# EAGLE design ESP12E.3 (EAGLE 8.3.1)
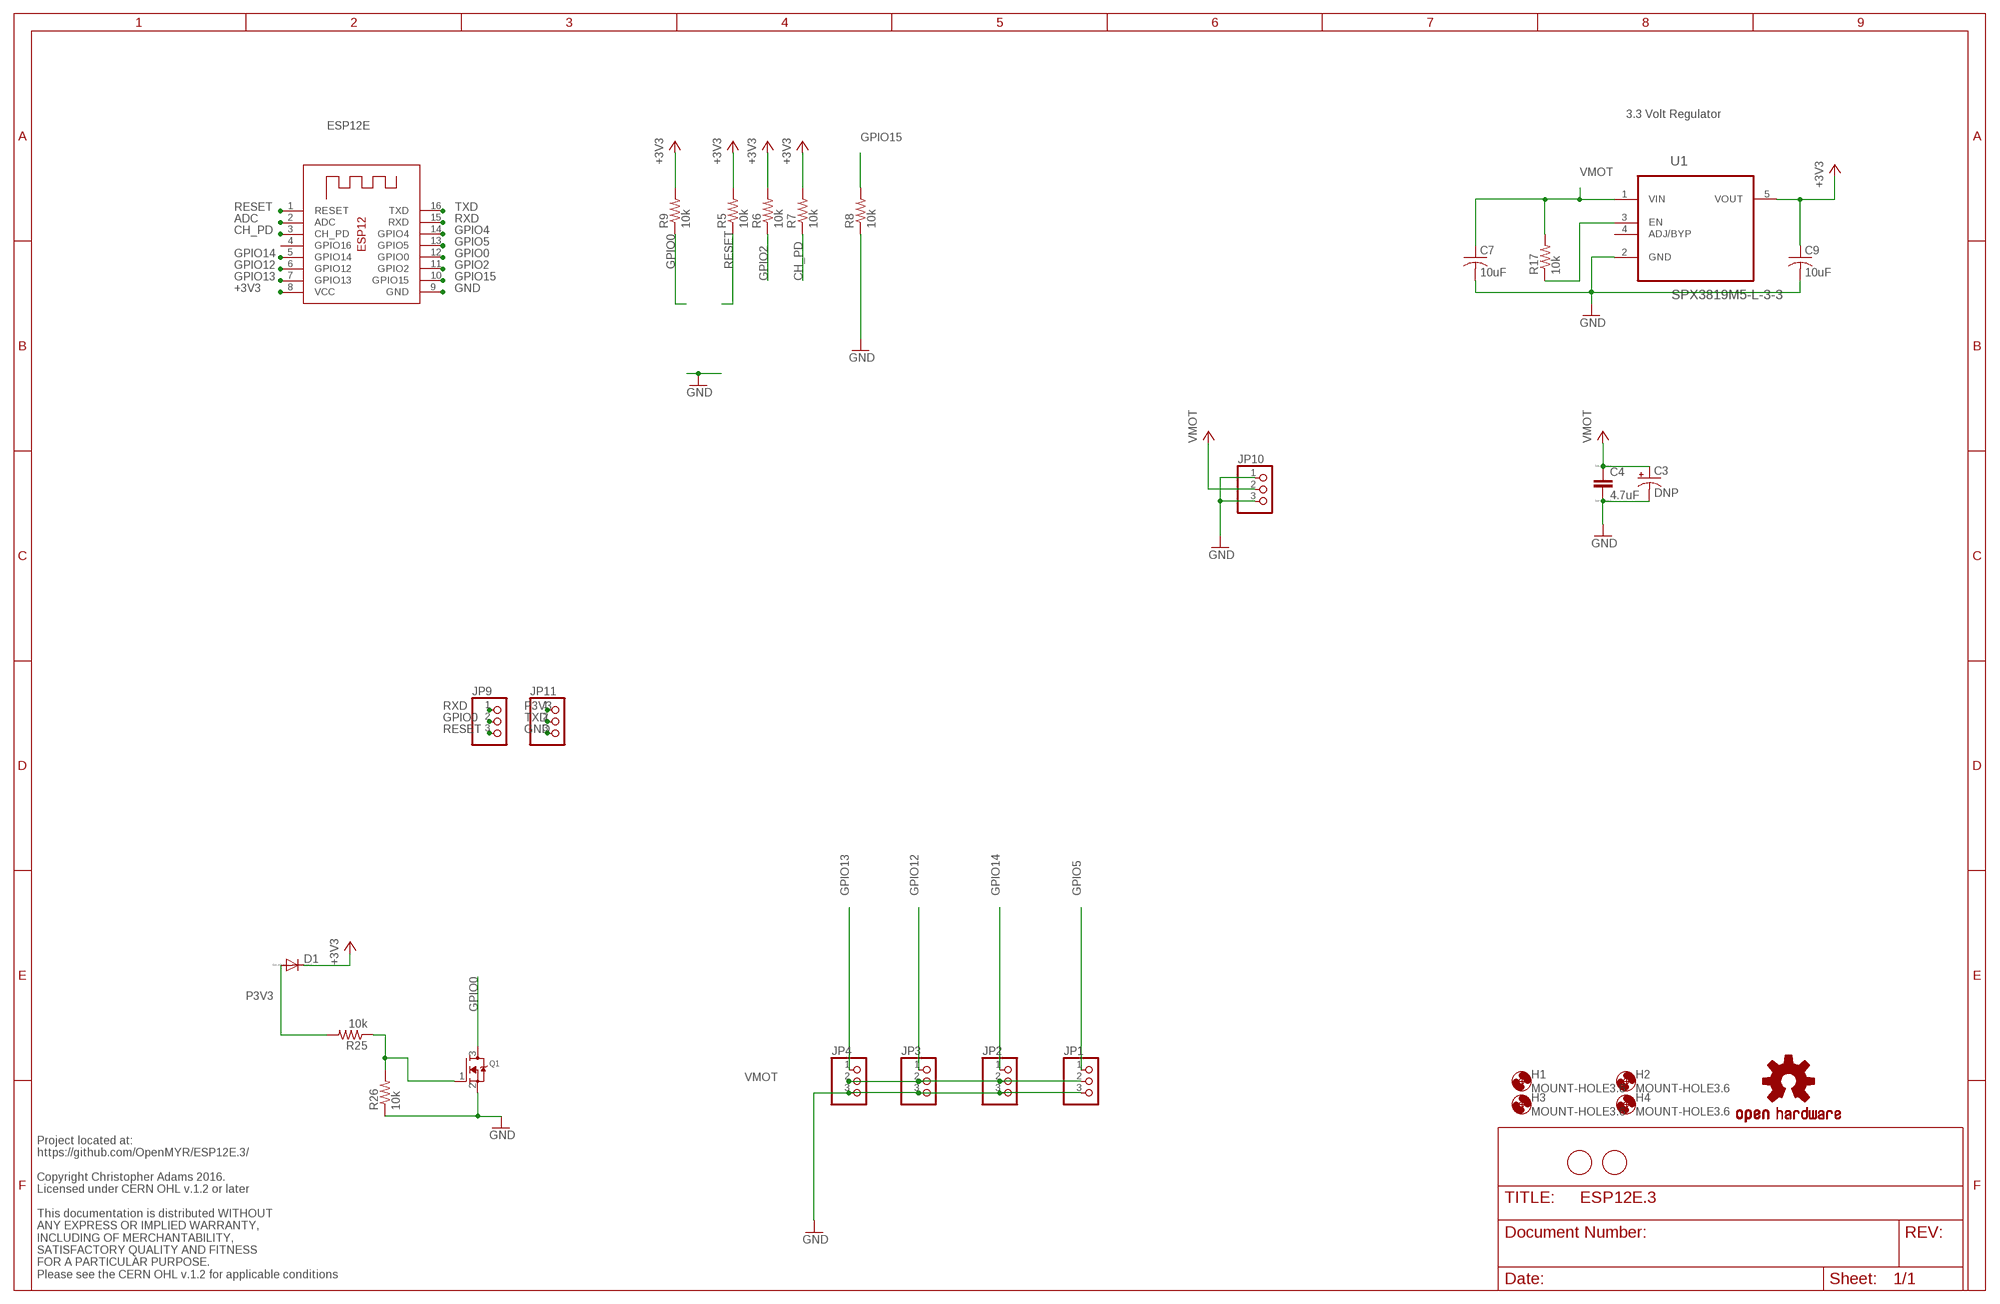
[diagram p0: schematic, sheet 1]

## Parts
C3  DNP  CPOL-USE2-4  [E2-4]
C4  4.7uF  C  [C0805]
C7  10uF  C-USC0603K  [C0603K]
C9  10uF  C-USC0603K  [C0603K]
D1  DIODE-DO214AC  [DO214AC]
H1  MOUNT-HOLE3.6  [3,6]
H2  MOUNT-HOLE3.6  [3,6]
H3  MOUNT-HOLE3.6  [3,6]
H4  MOUNT-HOLE3.6  [3,6]
JP1  PINHD-1X3  [1X03]
JP2  PINHD-1X3  [1X03]
JP3  PINHD-1X3  [1X03]
JP4  PINHD-1X3  [1X03]
JP9  PINHD-1X3  [1X03]
JP10  PINHD-1X3  [1X03]
JP11  PINHD-1X3  [1X03]
LOGO1  OSHW-LOGOMINI  [OSHW-LOGO-MINI]
Q1  MOSFET-NREFLOW  [SOT23]
R5  10k  R-US_R0603  [R0603]
R6  10k  R-US_R0603  [R0603]
R7  10k  R-US_R0603  [R0603]
R8  10k  R-US_R0603  [R0603]
R9  10k  R-US_R0603  [R0603]
R17  10k  R-US_R0603  [R0603]
R25  10k  R-US_R0603  [R0603]
R26  10k  R-US_R0603  [R0603]
U1  SPX3819M5-L-3-3  [SOT95P280X145-5N]
U$3  FIDUCIAL  [FIDUCIAL_1MM]
U$4  FIDUCIAL  [FIDUCIAL_1MM]
X1  ESP-12  [ESP-12]

## Nets
+3V3: C9.1 D1.C R5.2 R6.2 R7.2 R9.2 U1.5(VOUT) X1.8(VCC)
ADC: X1.2(ADC)
CH_PD: R7.1 X1.3(CH_PD)
GND: C3.- C4.2 C7.2 C9.2 JP1.3 JP2.3 JP3.3 JP4.3 JP10.1 JP10.3 JP11.3 Q1.2(S) R8.1 R26.1 U1.2(GND) X1.9(GND)
GPIO0: JP9.2 Q1.3(D) R9.1 X1.12(GPIO0)
GPIO2: R6.1 X1.11(GPIO2)
GPIO4: X1.14(GPIO4)
GPIO5: JP1.1 X1.13(GPIO5)
GPIO12: JP3.1 X1.6(GPIO12)
GPIO13: JP4.1 X1.7(GPIO13)
GPIO14: JP2.1 X1.5(GPIO14)
GPIO15: R8.2 X1.10(GPIO15)
N$4: R17.1 U1.3(EN)
N$7: Q1.1(G) R25.1 R26.2
P3V3: D1.A JP11.1 R25.2
RESET: JP9.3 R5.1 X1.1(RESET)
RXD: JP9.1 X1.15(RXD)
TXD: JP11.2 X1.16(TXD)
VMOT: C3.+ C4.1 C7.1 JP1.2 JP2.2 JP3.2 JP4.2 JP10.2 R17.2 U1.1(VIN)
Unconnected: U1.4(ADJ/BYP) X1.4(GPIO16)

## Notes on the sheet
- 3.3 Volt Regulator
- ESP12E
- Project located at:
  https://github.com/OpenMYR/ESP12E.3/
  
  Copyright Christopher Adams 2016.
  Licensed under CERN OHL v.1.2 or later
  
  This documentation is distributed WITHOUT 
  ANY EXPRESS OR IMPLIED WARRANTY, 
  INCLUDING OF MERCHANTABILITY, 
  SATISFACTORY QUALITY AND FITNESS 
  FOR A PARTICULAR PURPOSE. 
  Please see the CERN OHL v.1.2 for applicable conditions

## Library data of the parts
C3 = rcl:CPOL-US: POLARIZED CAPACITOR, American symbol
C4 = eagle-ltspice:C: CAPACITOR, European symbol; SPICEMODEL: NONE; SPICEPREFIX: C
C7 C9 = adafruit:C-US: CAPACITOR, American symbol
D1 = diode:DIODE-: DIODE
H1-H4 = holes:MOUNT-HOLE: MOUNTING HOLE with drill center marker
JP1-JP4 JP9-JP11 = adafruit:PINHD-1X3: PIN HEADER
LOGO1 = SparkFun-Aesthetics:OSHW-LOGO: Open Source Hardware Logo This logo indicates the piece of hardware it is found on incorporates a OSHW license and/or adheres to the definition of open source hardware found here: http://freedomdefined.org/OSHW
Q1 = adafruit:MOSFET-N: N-Channel Mosfet 2N7002E - 60V 260mA SOT23 [Digikey: 2N7002ET1GOSTR-ND] - REEL BSH103 - 30V 850mA SOT23 [Digikey: 568-5013-1-ND]
R5-R9 R17 R25 R26 = adafruit:R-US_: RESISTOR, American symbol
U1 = SPX3819M5-L-3-3:SPX3819M5-L-3-3: 500mA, LOW-NOISE LDO VOLTAGE REGULATOR
U$3 U$4 = adafruit:FIDUCIAL: For use by pick and place machines to calibrate the vision/machine, 1mm By microbuilder.eu
X1 = adafruit:ESP-12

## Board
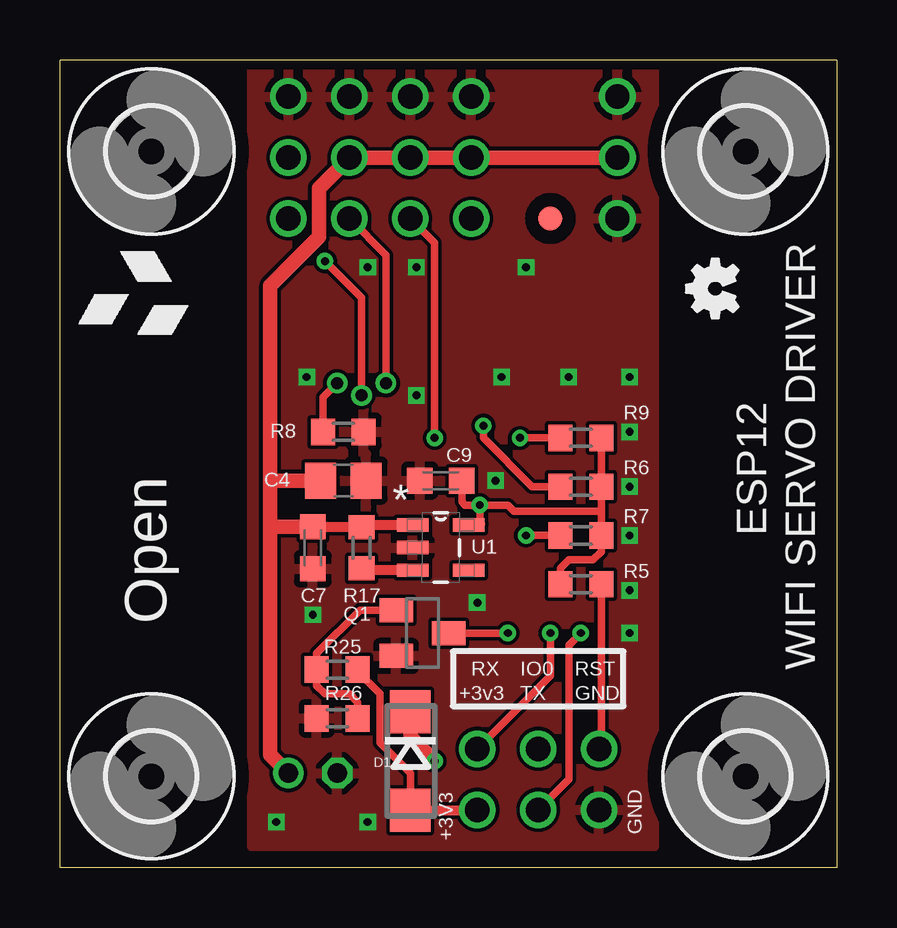
[diagram p1: board, top side]
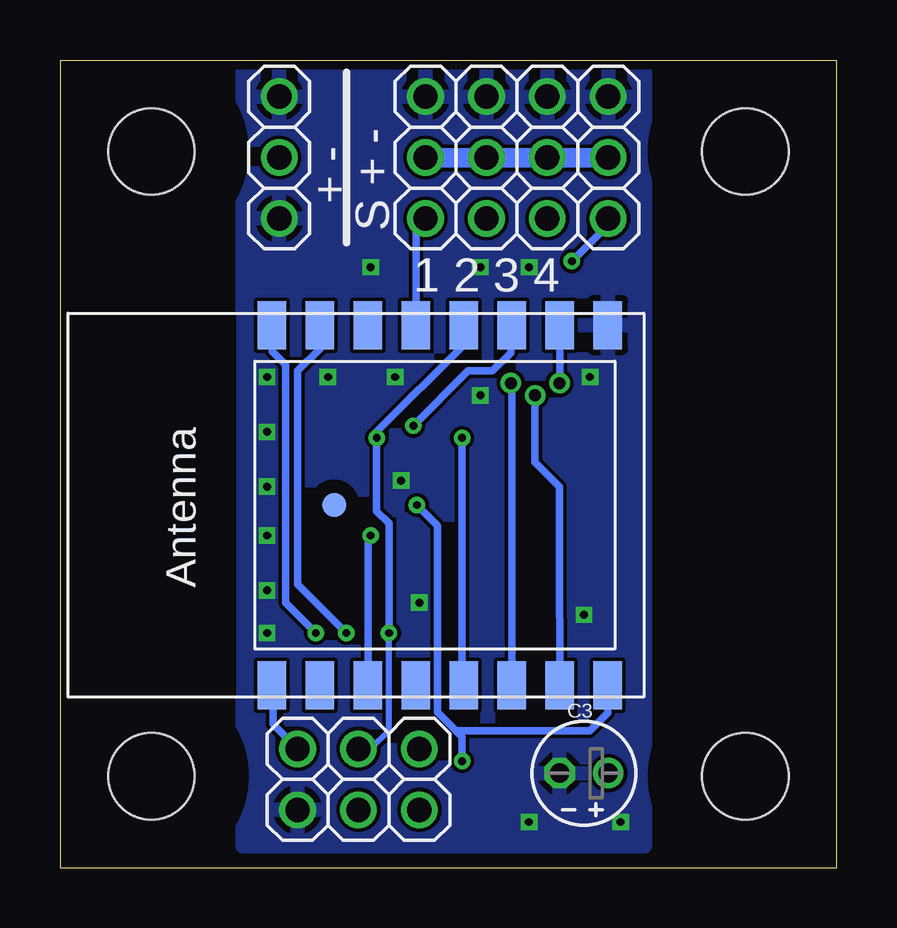
[diagram p2: board, bottom side, seen from below]

Size 32.38 x 33.66 mm. Coordinates in mm from the lower left corner, seen from the top.
Outline: 32.38,33.66 0,33.66 0,0 32.38,0 32.38,33.66
Copper layers (1*16): Top 0.0356mm / dielectric 1.5011mm / Bottom 0.0356mm
Design rules "LaenPCBOrder": minimum track width 6mil, minimum drill 13mil, track to track 6mil, track to pad 6mil, pad to pad 6mil, via to via 6mil, smd to smd 6mil, copper to edge 15mil, drill to drill 6mil, minimum pad ring 7mil, minimum via ring 7mil, stop-mask expansion 3mil, vias tented up to drill 0mil, thermal gap 10mil

### Footprints (pad centres in the part's own frame; a part is rotated, then mirrored left to right if it is on the bottom)
E2-4 = drill 0.813 pad 1.27: + -1.016,0 | drill 0.813 pad 1.27 octagon: - 1.016,0
C0805 = smd 1.3 x 1.5: 1 -0.95,0; 2 0.95,0
C0603K = smd 1.05 x 1.08: 1 -0.875,0; 2 0.875,0
DO214AC = smd 1.8 x 1.7: A 2.05,0; C -2.05,0
3,6 = hole 3.6: 0,0
1X03 = drill 1.016: 1 -2.54,0; 2 0,0; 3 2.54,0
SOT23 = smd 1 x 1.4: 1 -0.95,-1.1; 2 0.95,-1.1; 3 0,1.1
R0603 = smd 1 x 1.1: 1 -0.85,0; 2 0.85,0
SOT95P280X145-5N = smd 1.321 x 0.559: 1 -1.168,0.94; 2 -1.168,0; 3 -1.168,-0.94; 4 1.168,-0.94; 5 1.168,0.94
FIDUCIAL_1MM = smd 1 x 1: 1 0,0
ESP-12 = smd 2 x 1.2: 1 -7.5,4.5; 2 -7.5,2.5; 3 -7.5,0.5; 4 -7.5,-1.5; 5 -7.5,-3.5; 6 -7.5,-5.5; 7 -7.5,-7.5; 8 -7.5,-9.5; 9 7.5,-9.5; 10 7.5,-7.5; 11 7.5,-5.5; 12 7.5,-3.5; 13 7.5,-1.5; 14 7.5,0.5; 15 7.5,2.5; 16 7.5,4.5

### Placement (x,y rotation side)
C3  10.54,3.94 180 bottom
C4  11.81,16.13 0 top
C7  10.54,13.34 270 top
C9  15.88,16.13 180 top
D1  14.61,4.45 270 top
H1  3.81,3.81 0 top
H2  28.57,3.81 0 top
H3  3.81,29.84 0 top
H4  28.57,29.84 0 top
JP1  17.14,29.59 90 bottom
JP2  14.61,29.59 90 bottom
JP3  12.06,29.59 90 bottom
JP4  9.53,29.59 90 bottom
JP9  19.94,4.95 180 bottom
JP10  23.24,29.59 90 bottom
JP11  19.94,2.41 180 bottom
LOGO1  27.3,24.13 90 top
Q1  15.11,9.78 270 top
R5  21.72,11.81 180 top
R6  21.72,15.88 0 top
R7  21.72,13.84 0 top
R8  11.81,18.16 180 top
R9  21.72,17.91 0 top
R17  12.57,13.34 90 top
R25  11.56,8.26 0 top
R26  11.56,6.22 0 top
U1  15.88,13.34 0 top
U$3  20.95,15.11 0 bottom
U$4  20.45,27.05 0 top
X1  19.05,15.11 90 bottom

### Tracks (layer width: path | path; a pad name or v marks a point on that pad's centre or on a via)
+3V3  (via drill 0.33)
  Top 0.152: 17.35,14.2 U1.5 17.5,14.5
  Top 0.305: R9.2 R6.2 22.57,14.86 | 22.57,14.86 R7.2 22.57,13.17 22.23,12.83 21.21,12.83 20.87,12.48 R5.2 | v17.5,15.11 17.5,14.33 U1.5 | 22.57,14.86 18.93,14.86 18.67,15.11 v17.5,15.11 | 15.61,4.43 v15.62,4.45 | C9.1 16.75,15.25 16.89,15.11 v17.5,15.11
  Top 0.406: 17.51,14.31 U1.5
  Top 0.61: D1.C 14.61,5.46 v15.62,4.45
  Bottom 0.305: 9.53,7.59 X1.8 9.55,6.45 10.29,5.71 15.88,5.71 | v17.5,15.11 16.64,14.25 16.64,6.48 15.88,5.71 | v15.62,4.45 15.62,5.46 15.88,5.71
  Bottom 0.406: X1.8 9.55,6.96
CH_PD  (via drill 0.33)
  Top 0.305: R7.1 v19.43,13.84
  Bottom 0.305: v19.43,13.84 19.55,13.47 X1.3
GND  (via drill 0.33)
  Bottom 0.152: 9.42,22.73 X1.9 9.42,22.73
  other vias: 23.75,20.45 23.75,18.16 23.75,15.88 23.75,13.84 23.75,11.56 12.83,25.02 14.86,19.68 14.86,25.02 19.43,25.02 21.21,20.45 23.75,9.78 17.4,11.05 18.41,20.45 10.29,20.45 18.16,16.13 10.54,10.54 12.83,1.91 9.02,1.91
  pour Top (rank 6): 24.77,33.66 24.77,0.89 8,0.89 8,33.66
  pour Bottom (rank 6): 24.77,0.89 24.77,33.66 8,33.66 8,0.89
GPIO0  (via drill 0.33)
  Top 0.305: R9.1 v19.18,17.91 | Q1.3 v18.67,9.78
  Bottom 0.152: 19.18,17.86 v19.18,17.91
  Bottom 0.254: 19.43,4.95 18.67,5.71 v18.67,9.78
  Bottom 0.305: X1.12 15.55,21.79 19.18,18.16 v19.18,17.91 | 19.23,17.86 19.18,17.86 19.18,14.86 18.67,14.35 v18.67,9.78 | 19.43,4.95 JP9.2
GPIO2  (via drill 0.33)
  Top 0.305: R6.1 19.68,15.88 17.65,17.91 v17.65,18.41
  Bottom 0.305: 13.59,22.57 13.59,21.46 14.35,20.7 15.37,20.7 v17.65,18.41
  Bottom 0.406: 13.59,22.57 X1.11
GPIO5
  Bottom 0.305: X1.13 17.55,26.65 JP1.1
GPIO12  (via drill 0.5)
  Top 0.305: JP3.1 13.59,25.53 v13.59,20.19
  Bottom 0.305: X1.6 13.55,20.41 v13.59,20.19
GPIO13  (via drill 0.33, 0.5)
  Top 0.305: v12.57,19.68 12.57,23.75 v11.05,25.27
  Bottom 0.305: X1.7 11.56,13.21 11.56,15.88 12.57,16.89 v12.57,19.68 | JP4.1 9.53,26.8 v11.05,25.27
GPIO14  (via drill 0.33)
  Top 0.305: JP2.1 15.62,26.04 v15.62,17.91
  Bottom 0.305: v15.62,17.91 15.62,7.68 X1.5
GPIO15  (via drill 0.5)
  Top 0.305: R8.2 10.96,19.6 v11.56,20.19
  Bottom 0.305: X1.10 11.55,20.96 v11.56,20.19
N$4
  Top 0.406: U1.3 12.66,12.39 R17.1
N$7
  Top 0.305: R26.2 12.41,6.9 12.06,7.24 11.05,7.24 10.71,7.58 R25.1 10.71,8.93 12.51,10.73 Q1.1
P3V3
  Top 0.305: R25.2 12.32,8.26 13.34,7.24 13.34,5.21 14.61,3.94 D1.A
  Top 0.406: D1.A 17.38,2.4 JP11.1
  Top 0.61: 14.61,2.41 D1.A
RESET
  Top 0.305: R5.1 22.57,5.04 JP9.3
  Bottom 0.305: X1.1 23.5,7.56 23.5,5.97 JP9.3
RXD  (via drill 0.33)
  Top 0.305: v20.45,9.78 20.45,8 JP9.1
  Bottom 0.305: 21.46,22.7 X1.15 | 21.21,22.95 X1.15 | X1.15 21.55,21.63 22.48,20.7 22.48,11.81 v20.45,9.78
TXD  (via drill 0.33)
  Top 0.305: v21.72,9.78 21.21,9.27 21.21,3.68 JP11.2
  Bottom 0.305: 23.5,22.67 X1.16 23.55,21.52 22.99,20.95 22.99,11.05 v21.72,9.78
VMOT
  Top 0.152: 10.95,15.88 C4.1
  Top 0.406: C7.1 10.57,14.19 R17.2 12.66,14.28 U1.1
  Top 0.61: JP10.2 JP1.2 JP3.2 10.79,28.32 10.79,26.29 8.76,24.26 8.76,16.13 | C4.1 8.76,16.13 | C3.+ 8.76,4.7 8.76,14.1 | 8.76,14.1 8.76,16.13 | C7.1 8.88,14.21 8.76,14.1
  Bottom 0.813: JP1.2 JP2.2 JP3.2 JP4.2

### Text on the board
Pads: MYR
tPlace: R9 | R8 | ESP12 | WIFI SERVO DRIVER | C4 | RX | IO0 | RST | +3v3 | TX | GND | +3V3 | GND
bPlace: S + - | + - | 1 2 3 4
tNames: Open
tStop: MYR
Document: Project located at: / https://github.com/OpenMYR/ESP12E.3/ / / Copyright Christopher Adams 2016. / Licensed under CERN OHL v.1.2 or later / / This documentation is distributed WITHOUT / ANY EXPRESS OR IMPLIED WARRANTY, / INCLUDING OF MERCHANTABILITY, / SATISFACTORY QUALITY AND FITNESS / FOR A PARTICULAR PURPOSE. / Please see the CERN OHL v.1.2 for applicable conditions